# Altium project LDO simulation.PrjPcb
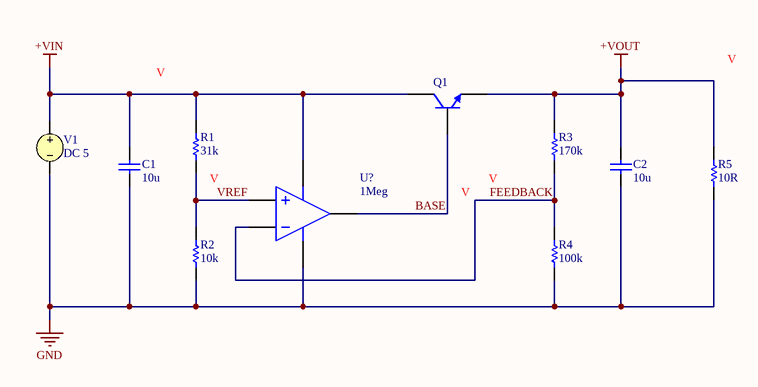
[diagram p0: LDO.SchDoc]
1 sheet, 10 parts. Net scope: global (net labels, ports and power ports of the same name join across sheets).

## Sheet LDO.SchDoc: LDO
size A4; SheetNumber: 1; SheetTotal: 1

### Parts
C1  value 10u  (hidden comment: Capacitor)
C2  value 10u  (hidden comment: Capacitor)
Q1  Bipolar NPN 3 Pins Transistor Modified Version of the Gummel-Poon Model  (value not drawn)
R1  value 31k  (hidden comment: Resistor)
R2  value 10k  (hidden comment: Resistor)
R3  value 170k  (hidden comment: Resistor)
R4  value 100k  (hidden comment: Resistor)
R5  value 10R  (hidden comment: Resistor)
U?  GAIN: 1Meg  (hidden comment: Ideal Operational Amplifier)
V1  DC 5

### Nets
+VIN: C1.2 Q1.1(C) R1.2 U?.5(V-) V1.1
+VOUT: C2.2 Q1.3(E) R3.2 R5.2
GND: C1.1 C2.1 R2.1 R4.1 R5.1 U?.4(V+) V1.2
BASE: Q1.2(B) U?.3(OUT)
FEEDBACK: R3.1 R4.2 U?.1(IN-)
VREF: R1.1 R2.2 U?.2(IN+)

### Notes on the sheet
- Title:
- Drawn By:
- Page Contents:
- Checked By:
- Size:
- Date:
- File:
- License:
- Email:
- A4
- Number:
- Time:
- Revision:
- Sheet
- Website:
- of

### Library data of the parts
C1 C2 = Capacitor: SimulationGenericComponent: True
Q1 = BJT NPN_MGP: BF: 100; AF: 0; BR: 1; EG: 1.11; FC: 0.5; IS: 1e-16; MJC: 0.33; NC: 2; NE: 1.5; TNOM: 27; VBC_MAX: 1e99; VJC: 0.75; XTI: 3; SimulationGenericComponent: True; CJC: 0; CJE: 0; CJS: 0; CTC: 0; CTE: 0; CTS: 0; IKF: 0; IKR: 0; IRB: 0; ISC: 0; ISE: 0; ISS: 0; ITF: 0; KF: 0; MJE: 0.33; MJS: 0; NF: 1; NKF: 0.5; NR: 1; NS: 1; PTF: 0; RB: 0; RBM: 0; RC: 0; RE: 0; SUBS: 1; TBF1: 0; TBF2: 0; TBR1: 0; TBR2: 0; TF: 0; TIKF1: 0; TIKF2: 0; TIKR1: 0; TIKR2: 0; TIRB1: 0; TIRB2: 0; TIS1: 0; TIS2: 0; TISC1: 0; TISC2: 0; TISE1: 0; TISE2: 0; TITF1: 0; TITF2: 0; TLEV: 0; TLEVC: 0; TMJC1: 0; TMJC2: 0; TMJE1: 0; TMJE2: 0; TMJS1: 0; TMJS2: 0; TNC1: 0; TNC2: 0; TNE1: 0; TNE2: 0; TNF1: 0; TNF2: 0; TNR1: 0; TNR2: 0; TNS1: 0; TNS2: 0; TR: 0; TRB1: 0; TRB2: 0; TRC1: 0; TRC2: 0; TRE1: 0; TRE2: 0; TRM1: 0; TRM2: 0; TTF1: 0; TTF2: 0; TTR1: 0; TTR2: 0; TVAF1: 0; TVAF2: 0; TVAR1: 0; TVAR2: 0; TVJC: 0; TVJE: 0; TVJS: 0; VAF: 0; VAR: 0; VBE_MAX: 1e99; VCE_MAX: 1e99; VJE: 0.75; VJS: 0.75; VTF: 0; XCJC: 1; XTB: 0; XTF: 0
R1-R5 = Resistor: TC1: 0; SimulationGenericComponent: True; TC2: 0
U? = OpAmp with power terminals: SimulationGenericComponent: True
V1 = VSRC: Voltage Source; Note: PCB Footprint - Not required; AC Magnitude: 1; AC Phase: 10; Value: 5; Published: 8-Jun-2000; LatestRevisionDate: 17-Jul-2002; LatestRevisionNote: Re-released for DXP Platform.; PackageReference: Not Applicable; Publisher: Altium Limited